# EAGLE board openDrive_MC_00.23 (EAGLE 5.10)
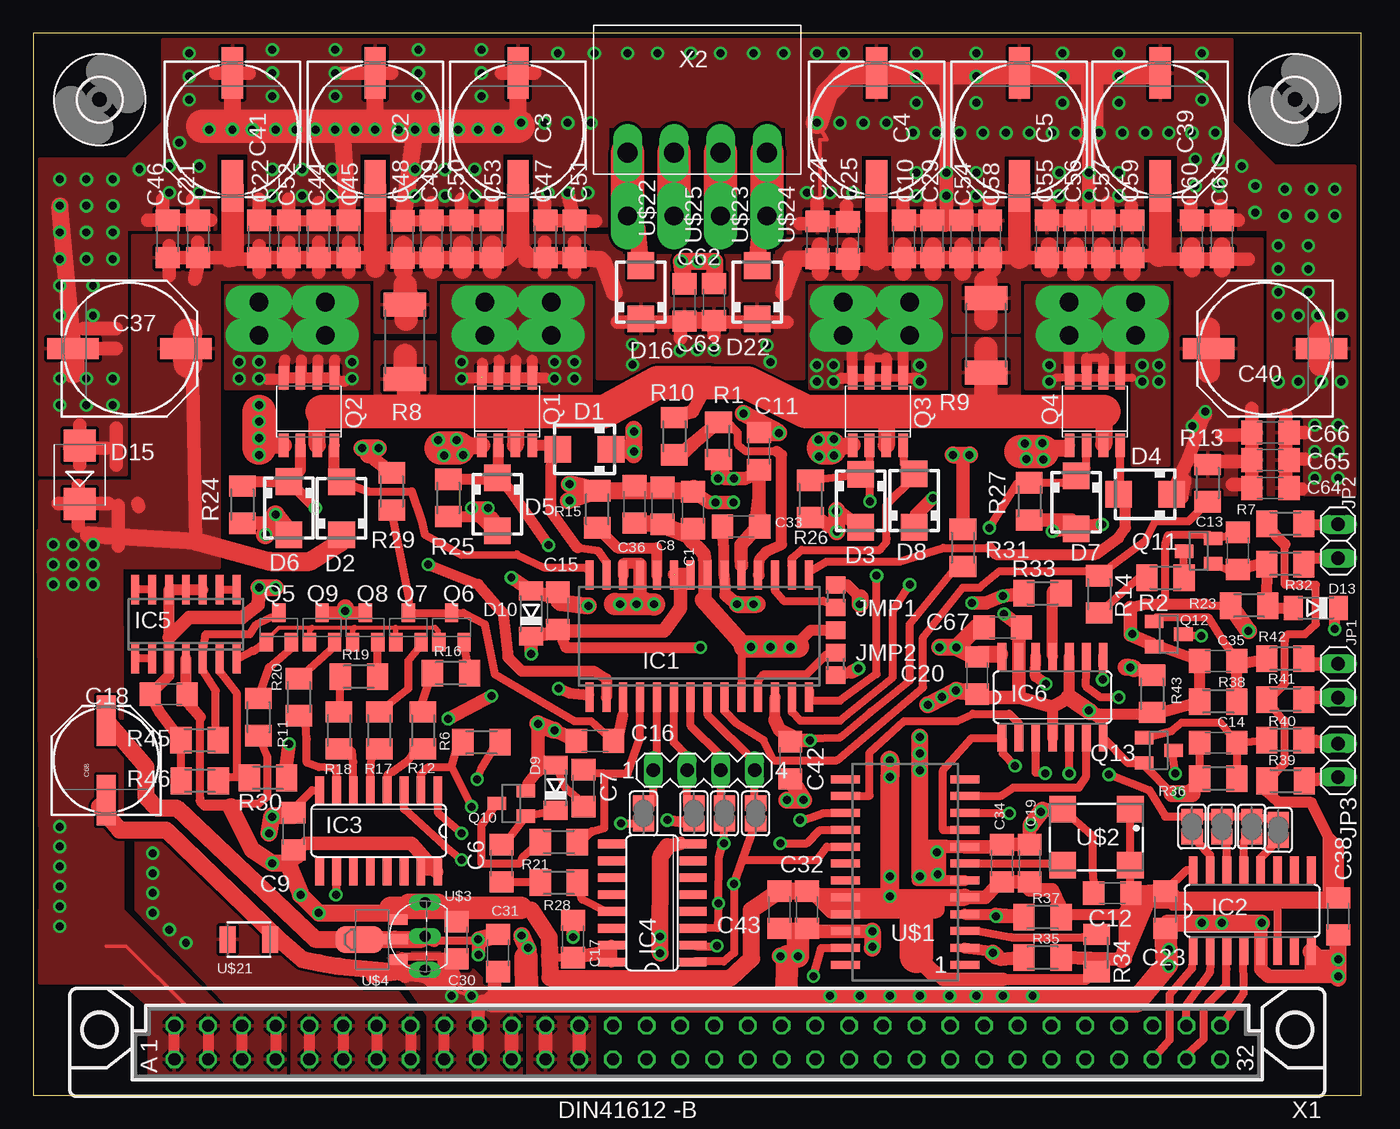
[diagram p1: board, top side]
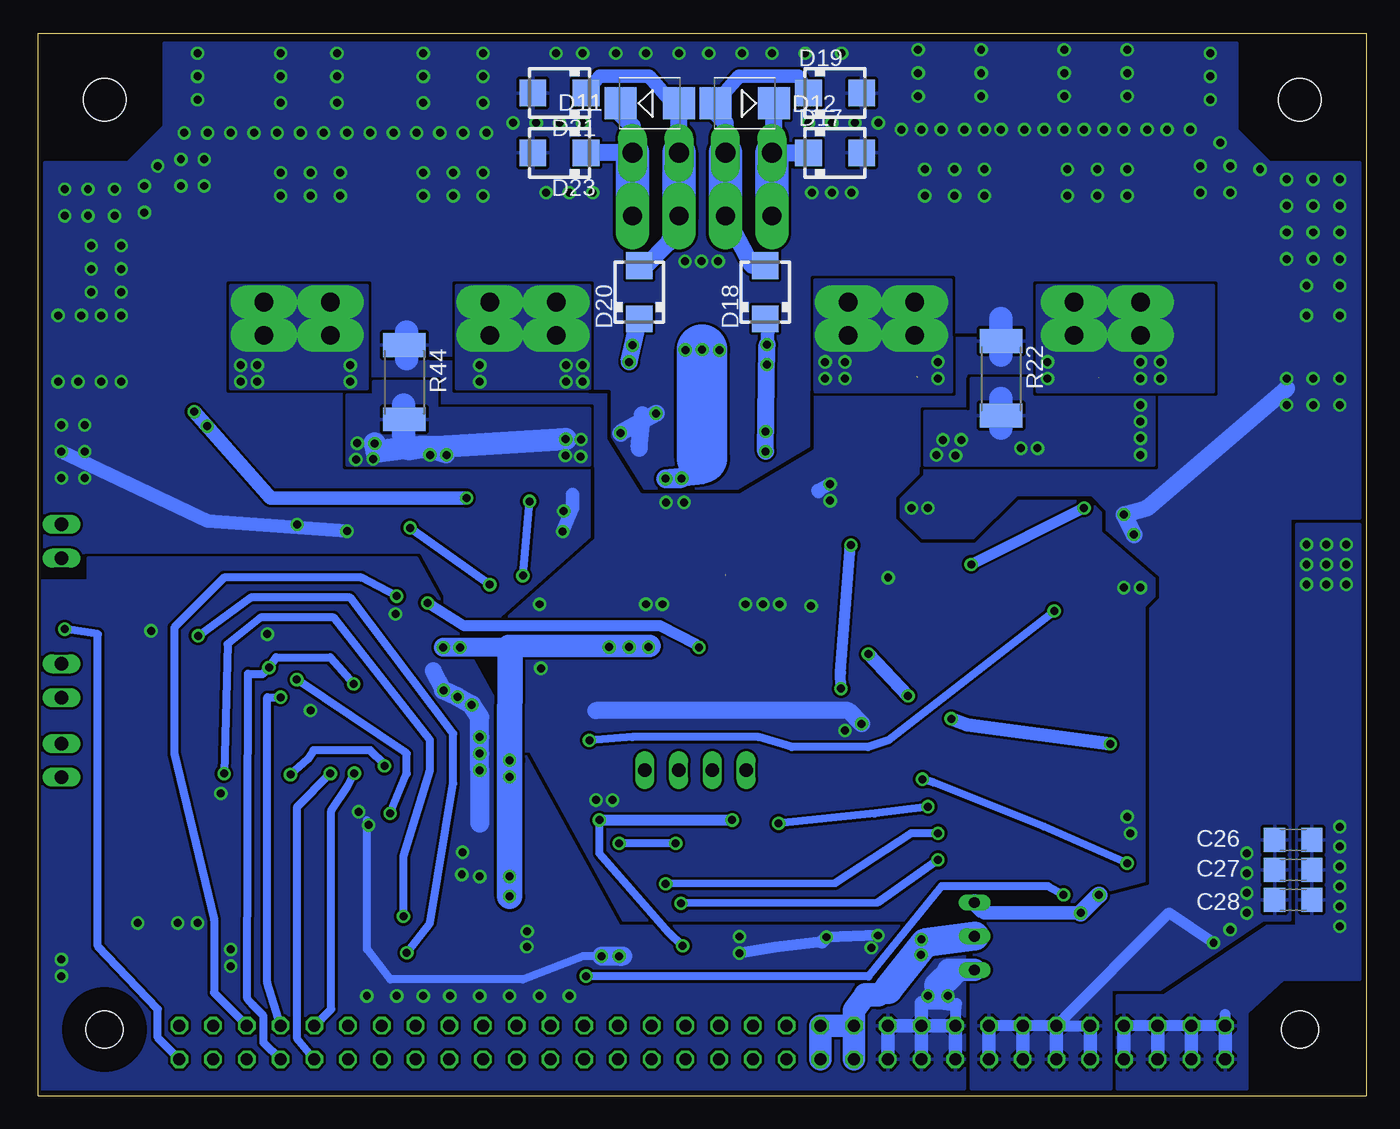
[diagram p2: board, bottom side, seen from below]

Size 100 x 80 mm. Coordinates in mm from the lower left corner, seen from the top.
Outline: 100,0 100,80 0,80 0,0 100,0
Copper layers (1*16): Top 0.035mm / dielectric 1.5mm / Bottom 0.035mm
Design rules "ZWILLING": minimum track width 0.2mm, minimum drill 0.5mm, track to track 0.2mm, track to pad 0.2mm, pad to pad 0.15mm, via to via 0.2mm, smd to smd 0mil, copper to edge 0.2mm, drill to drill 0.2mm, minimum pad ring 0.2mm, minimum via ring 0.2mm, stop-mask expansion 0.1mm, vias tented up to drill 0mil, thermal gap 10mil
bRestrict: 25 lines

## Footprints (pad centres in the part's own frame; a part is rotated, then mirrored left to right if it is on the bottom)
C1206 = smd 1.6 x 1.8: 1 -1.4,0; 2 1.4,0
PANASONIC_G = smd 3.9 x 1.6: + 4.25,0; - -4.25,0
PANASONIC_E = smd 3.8 x 1.4: + 3,0; - -3,0
SMA = smd 2 x 2: A 2,0; C -2,0
SOD80C = smd 1.4 x 1.8: A 1.7,0; C -1.7,0
SMB = smd 2.4 x 2.4: A 2.2,0; C -2.2,0
3,2 = hole 3.2: 0,0
SO28W = smd 0.6 x 2.2: 1 -8.255,-4.6; 2 -6.985,-4.6; 3 -5.715,-4.6; 4 -4.445,-4.6; 5 -3.175,-4.6; 6 -1.905,-4.6; 7 -0.635,-4.6; 8 0.635,-4.6; 9 1.905,-4.6; 10 3.175,-4.6; 11 4.445,-4.6; 12 5.715,-4.6; 13 6.985,-4.6; 14 8.255,-4.6; 15 8.255,4.6; 16 6.985,4.6; 17 5.715,4.6; 18 4.445,4.6; 19 3.175,4.6; 20 1.905,4.6; 21 0.635,4.6; 22 -0.635,4.6; 23 -1.905,4.6; 24 -3.175,4.6; 25 -4.445,4.6; 26 -5.715,4.6; 27 -6.985,4.6; 28 -8.255,4.6
SO16 = smd 0.66 x 2.032: 1 -4.445,-3.073; 2 -3.175,-3.073; 3 -1.905,-3.073; 4 -0.635,-3.073; 5 0.635,-3.073; 6 1.905,-3.073; 7 3.175,-3.073; 8 4.445,-3.073; 9 4.445,3.073; 10 3.175,3.073; 11 1.905,3.073; 12 0.635,3.073; 13 -0.635,3.073; 14 -1.905,3.073; 15 -3.175,3.073; 16 -4.445,3.073
SO14 = smd 0.6 x 2.2: 1 -3.81,-2.6; 2 -2.54,-2.6; 3 -1.27,-2.6; 4 0,-2.6; 5 1.27,-2.6; 6 2.54,-2.6; 7 3.81,-2.6; 8 3.81,2.6; 9 2.54,2.6; 10 1.27,2.6; 11 0,2.6; 12 -1.27,2.6; 13 -2.54,2.6; 14 -3.81,2.6
SO14' = smd 0.66 x 2.032: 1 -3.81,-3.073; 2 -2.54,-3.073; 3 -1.27,-3.073; 4 0,-3.073; 5 1.27,-3.073; 6 2.54,-3.073; 7 3.81,-3.073; 8 3.81,3.073; 9 2.54,3.073; 10 1.27,3.073; 11 0,3.073; 12 -1.27,3.073; 13 -2.54,3.073; 14 -3.81,3.073
B0R-JMP = smd 1.5 x 1.3: 1 0,1.7; 2 0,0; 3 0,-1.7
1X02 = drill 1.016 long: 1 -1.27,0; 2 1.27,0
SO08-IRF = smd 0.72 x 1.78: 1 -1.905,-2.543; 2 -0.635,-2.543; 3 0.635,-2.543; 4 1.905,-2.543; 5 1.905,2.543; 6 0.635,2.543; 7 -0.635,2.543; 8 -1.905,2.543
SOT23-BEC = smd 1 x 1.4: B -0.95,-1.1; C 0,1.1; E 0.95,-1.1
SOT23 = smd 1 x 1.4: 1 -0.95,-1.1; 2 0.95,-1.1; 3 0,1.1
M1206 = smd 1.6 x 2: 1 -1.4,0; 2 1.4,0
R2512 = smd 1.8 x 3.2: 1 -2.8,0; 2 2.8,0
SJ = smd 1.168 x 1.6: 1 -0.762,0; 2 0.762,0
MA04-1 = drill 1.016 long: 1 -3.81,0; 2 -1.27,0; 3 1.27,0; 4 3.81,0
SOP24 = smd 0.6 x 2.2: 1 -6.985,-4.5; 2 -5.715,-4.5; 3 -4.445,-4.5; 4 -3.175,-4.5; 5 -1.905,-4.5; 6 -0.635,-4.5; 7 0.635,-4.5; 8 1.905,-4.5; 9 3.175,-4.5; 10 4.445,-4.5; 11 5.715,-4.5; 12 6.985,-4.5; 13 6.985,4.5; 14 5.715,4.5; 15 4.445,4.5; 16 3.175,4.5; 17 1.905,4.5; 18 0.635,4.5; 19 -0.635,4.5; 20 -1.905,4.5; 21 -3.175,4.5; 22 -4.445,4.5; 23 -5.715,4.5; 24 -6.985,4.5
XO91 = smd 2 x 2: 1 -2.61,-2.07; 2 2.49,-2.07; 3 2.49,2.13; 4 -2.61,2.13
TO92 = drill 0.813 long: 1 -2.54,0; 2 0,0; 3 2.54,0
SOT89 = smd 0.8 x 1.4: 1 -1.499,-1.981; 3 1.499,-1.981 | smd 0.8 x 2.032: 2 0.025,-1.727 | smd 2.032 x 3.65: 4 0,0.94
PAD = drill 1.4 pad 2.54 long: 1 0,0
1210 = smd 1.2 x 2: 1 -1.6,0; 2 1.6,0
FAB64S = drill 0.914 octagon: A1 -1.27,39.37; A2 -1.27,36.83; A3 -1.27,34.29; A4 -1.27,31.75; A5 -1.27,29.21; A6 -1.27,26.67; A7 -1.27,24.13; A8 -1.27,21.59; A9 -1.27,19.05; A10 -1.27,16.51; A11 -1.27,13.97; A12 -1.27,11.43; A13 -1.27,8.89; A14 -1.27,6.35; A15 -1.27,3.81; A16 -1.27,1.27; A17 -1.27,-1.27; A18 -1.27,-3.81; A19 -1.27,-6.35; A20 -1.27,-8.89; A21 -1.27,-11.43; A22 -1.27,-13.97; A23 -1.27,-16.51; A24 -1.27,-19.05; A25 -1.27,-21.59; A26 -1.27,-24.13; A27 -1.27,-26.67; A28 -1.27,-29.21; A29 -1.27,-31.75; A30 -1.27,-34.29; A31 -1.27,-36.83; A32 -1.27,-39.37; B1 1.27,39.37; B2 1.27,36.83; B3 1.27,34.29; B4 1.27,31.75; B5 1.27,29.21; B6 1.27,26.67; B7 1.27,24.13; B8 1.27,21.59; B9 1.27,19.05; B10 1.27,16.51; B11 1.27,13.97; B12 1.27,11.43; B13 1.27,8.89; B14 1.27,6.35; B15 1.27,3.81; B16 1.27,1.27; B17 1.27,-1.27; B18 1.27,-3.81; B19 1.27,-6.35; B20 1.27,-8.89; B21 1.27,-11.43; B22 1.27,-13.97; B23 1.27,-16.51; B24 1.27,-19.05; B25 1.27,-21.59; B26 1.27,-24.13; B27 1.27,-26.67; B28 1.27,-29.21; B29 1.27,-31.75; B30 1.27,-34.29; B31 1.27,-36.83; B32 1.27,-39.37 | hole 2.794: 0.965,-45.009; 0.965,45.009
AKL182-04 = drill 1.5 pad 2.184 long: P$1 -5.25,0; P$2 -1.75,0; P$3 1.75,0; P$4 5.25,0

## Placement (x,y rotation side)
C1  4µ7  [C1206]  49.67,44.08 90 top
C2  330µ  [PANASONIC_G]  25.75,72.75 270 top
C3  330µ  [PANASONIC_G]  36.5,72.75 270 top
C4  330µ  [PANASONIC_G]  63.5,72.75 270 top
C5  330µ  [PANASONIC_G]  74.25,72.75 270 top
C6  10p  [C1206]  35.25,17.5 90 top
C7  680p  [C1206]  41.42,23.15 270 top
C8  100n  [C1206]  47.38,44.42 90 top
C9  100n  [C1206]  19.6,19.9 90 top
C10  4µ7  [C1206]  65.58,64.5 90 top
C11  1µ  [C1206]  54.65,48.52 90 top
C12  100n  [C1206]  81.25,15.25 180 top
C13  4n7  [C1206]  90.7,41.02 90 top
C14  4n7  [C1206]  89.22,26.57 180 top
C15  4µ7  [C1206]  39.5,36.5 90 top
C16  4n7  [C1206]  42.3,26.7 180 top
C17  100n  [C1206]  40.65,11.8 90 top
C18  100n  [C1206]  10.2,30.23 180 top
C19  1µ  [C1206]  75.03,17.5 90 top
C20  100n  [C1206]  71.08,31.62 270 top
C21  4µ7  [C1206]  12.43,64.5 90 top
C22  4µ7  [C1206]  17,64.5 90 top
C23  100n  [C1206]  85.25,14 270 top
C24  4µ7  [C1206]  59.05,64.42 90 top
C25  4µ7  [C1206]  61.35,64.4 90 top
C26  100n  [C1206]  5.5,19.25 180 bottom
C27  10n  [C1206]  5.5,17 180 bottom
C28  1n  [C1206]  5.5,14.75 180 bottom
C29  4µ7  [C1206]  67.7,64.5 90 top
C30  1µ  [C1206]  31.88,11.7 270 top
C31  1µ  [C1206]  35,10.75 270 top
C32  100n  [C1206]  58.25,14 270 top
C33  1µ  [C1206]  53.3,42.85 180 top
C34  470n  [C1206]  72.92,17.5 90 top
C35  4n7  [C1206]  89.22,32.73 180 top
C36  1µ  [C1206]  45.27,44.52 90 top
C37  330µ  [PANASONIC_G]  7.25,56.25 0 top
C38  1µ  [C1206]  98.25,13.5 270 top
C39  330µ  [PANASONIC_G]  84.85,72.75 270 top
C40  330µ  [PANASONIC_G]  92.75,56.25 180 top
C41  330µ  [PANASONIC_G]  15,72.75 270 top
C42  4n7  [C1206]  57,25.25 270 top
C43  1µ  [C1206]  56.17,14 270 top
C44  4µ7  [C1206]  21.5,64.5 90 top
C45  4µ7  [C1206]  23.75,64.5 90 top
C46  4µ7  [C1206]  10.12,64.5 90 top
C47  4µ7  [C1206]  38.58,64.5 90 top
C48  4µ7  [C1206]  27.82,64.47 90 top
C49  4µ7  [C1206]  30,64.5 90 top
C50  4µ7  [C1206]  32.25,64.5 90 top
C51  4µ7  [C1206]  40.75,64.5 90 top
C52  4µ7  [C1206]  19.25,64.5 90 top
C53  4µ7  [C1206]  34.5,64.5 90 top
C54  4µ7  [C1206]  69.9,64.5 90 top
C55  4µ7  [C1206]  76.33,64.5 90 top
C56  4µ7  [C1206]  78.45,64.5 90 top
C57  4µ7  [C1206]  80.58,64.5 90 top
C58  4µ7  [C1206]  72.05,64.5 90 top
C59  4µ7  [C1206]  82.75,64.5 90 top
C60  4µ7  [C1206]  87.25,64.5 90 top
C61  4µ7  [C1206]  89.5,64.5 90 top
C62  1n  [C1206]  49.05,59.73 90 top
C63  1n  [C1206]  51.27,59.75 90 top
C64  10n  [C1206]  93.15,45.75 0 top
C65  100n  [C1206]  93.15,47.85 0 top
C66  1µ  [C1206]  93.15,49.92 0 top
C67  4µ7  [C1206]  73,35.25 0 top
C68  220µ  [PANASONIC_E]  5.5,25.25 90 top
D1  SS14  [SMA]  41.51,48.66 180 top
D2  SS14  [SMA]  23.22,44.22 90 top
D3  SS14  [SMA]  66.33,44.81 90 top
D4  SS14  [SMA]  83.72,45.29 180 top
D5  SS14  [SMA]  34.94,44.53 270 top
D6  SS14  [SMA]  19.26,44.24 270 top
D7  SS14  [SMA]  78.51,44.68 270 top
D8  SS14  [SMA]  62.3,44.78 270 top
D9  BAS32  [SOD80C]  39.33,23.18 90 top
D10  3V0  [SOD80C]  37.48,36.3 90 top
D11  P6SMB 33CA  [SMB]  53.95,74.72 0 bottom
D12  P6SMB 33CA  [SMB]  46.8,74.72 180 bottom
D13  BAS32  [SOD80C]  96.58,36.73 180 top
D15  P6SMB 33CA  [SMB]  3.5,46.75 90 top
D16  SS14  [SMA]  45.75,60.5 90 top
D17  SS14  [SMA]  40,71 0 bottom
D18  SS14  [SMA]  45.25,60.5 90 bottom
D19  SS14  [SMA]  40,75.5 0 bottom
D20  SS14  [SMA]  54.75,60.5 90 bottom
D21  SS14  [SMA]  60.75,75.5 180 bottom
D22  SS14  [SMA]  54.5,60.5 90 top
D23  SS14  [SMA]  60.75,71 180 bottom
H1  MOUNT-HOLE3.2  [3,2]  5,75 0 top
H2  MOUNT-HOLE3.2  [3,2]  95,75 0 top
IC1  TMC249  [SO28W]  50.14,34.6 0 top
IC2  74HC138D  [SO16]  91.78,13.92 0 top
IC3  4094D  [SO16]  26.02,19.94 180 top
IC4  4094D  [SO16]  46.6,14.51 90 top
IC5  LM324D  [SO14]  11.5,35.5 0 top
IC6  74HC125D  [SO14']  76.75,30 0 top
JMP1  0R-JUMPB  [B0R-JMP]  60.42,33.35 0 top
JMP2  0R-JUMPB  [B0R-JMP]  60.42,36.75 180 top
JP1  Left Ref. Switch  [1X02]  98.25,31.25 90 top
JP2  STOP Switch  [1X02]  98.25,41.75 270 top
JP3  Right Ref. Switch  [1X02]  98.25,25.25 90 top
Q1  FDS8960  [SO08-IRF]  35.67,51.51 0 top
Q2  FDS8960  [SO08-IRF]  20.76,51.51 0 top
Q3  FDS8960  [SO08-IRF]  63.6,51.51 0 top
Q4  FDS8960  [SO08-IRF]  79.94,51.51 0 top
Q5  BC856ASMD  [SOT23-BEC]  18.5,35.25 0 top
Q6  BC856ASMD  [SOT23-BEC]  31.5,35.25 0 top
Q7  BC856ASMD  [SOT23-BEC]  28.25,35.25 0 top
Q8  BC856ASMD  [SOT23-BEC]  25,35.25 0 top
Q9  BC856ASMD  [SOT23-BEC]  21.75,35.25 0 top
Q10  BC846ASMD  [SOT23]  36,22 90 top
Q11  BC846ASMD  [SOT23]  87.75,41 90 top
Q12  BC846ASMD  [SOT23]  85.5,34.75 270 top
Q13  BC846ASMD  [SOT23]  84.75,26 270 top
R1  56  [M1206]  51.6,49.3 270 top
R2  1k  [M1206]  85.25,39 180 top
R6  120k  [M1206]  33.75,26.6 0 top
R7  4k7  [M1206]  94.28,43.08 180 top
R8  0.1  [R2512]  28,56.75 90 top
R9  0.1  [R2512]  71.75,57.25 90 top
R10  100  [M1206]  48.27,49.65 90 top
R11  10k  [M1206]  16.95,28.5 90 top
R12  10k  [M1206]  29.35,27.5 90 top
R13  120k  [M1206]  88.42,46.12 90 top
R14  4k7  [M1206]  80.25,37.75 90 top
R15  4k7  [M1206]  42.48,44.15 270 top
R16  10k  [M1206]  31.45,31.8 0 top
R17  10k  [M1206]  26.05,27.5 90 top
R18  10k  [M1206]  23.02,27.5 90 top
R19  10k  [M1206]  24.52,31.55 0 top
R20  10k  [M1206]  20,30 90 top
R21  4k7  [M1206]  39.58,19.1 180 top
R22  0.1  [R2512]  27.5,54 270 bottom
R23  33k  [M1206]  91.55,36.9 0 top
R24  470k  [M1206]  15.75,44.5 90 top
R25  470k  [M1206]  31.25,45 90 top
R26  470k  [M1206]  58.52,44.92 90 top
R27  470k  [M1206]  75,44.75 90 top
R28  1k  [M1206]  39.58,16.02 0 top
R29  100  [M1206]  27,45.5 90 top
R30  120k  [M1206]  17.68,23.93 0 top
R31  100  [M1206]  70,41.25 90 top
R32  4k7  [M1206]  94.28,40.02 0 top
R33  4k7  [M1206]  76,37.83 180 top
R34  33k  [M1206]  80.08,10.75 270 top
R35  33k  [M1206]  76,10.4 0 top
R36  33k  [M1206]  89.22,23.88 0 top
R37  33k  [M1206]  76,13.45 0 top
R38  33k  [M1206]  89.22,29.68 0 top
R39  4k7  [M1206]  94.3,23.7 180 top
R40  4k7  [M1206]  94.28,26.77 0 top
R41  4k7  [M1206]  94.28,29.82 180 top
R42  4k7  [M1206]  94.28,32.9 0 top
R43  120k  [M1206]  84.25,30.25 90 top
R44  0.1  [R2512]  72.42,53.73 270 bottom
R45  2k7  [M1206]  12.53,26.75 0 top
R46  22k  [M1206]  12.55,23.7 0 top
SJ1  ADR_CS_0  [SJ]  87.25,20.25 90 top
SJ2  ADR_CS_1  [SJ]  89.5,20.25 90 top
SJ3  ADR_CS_2  [SJ]  91.75,20.25 90 top
SJ4  ADR_CS_3  [SJ]  93.75,20 90 top
SJ5  [SJ]  52.05,21.25 90 top
SJ6  [SJ]  49.75,21.25 90 top
SJ7  [SJ]  45.95,21.25 90 top
SJ8  [SJ]  54.4,21.25 90 top
SV1  SPI_TEST_TMC249  [MA04-1]  50.5,24.5 0 top
U$1  TMC428  [SOP24]  65.65,16.84 90 top
U$2  XO91  [XO91]  80,19.5 180 top
U$3  MCP1702  [TO92]  29.5,12 90 top
U$4  MCP1702SMD  [SOT89]  25.5,11.75 90 top
U$5  PIN1  [PAD]  39,59.75 180 top
U$6  PIN1  [PAD]  34,59.75 180 top
U$7  PIN1  [PAD]  39,57.25 180 top
U$8  PIN1  [PAD]  34,57.25 180 top
U$9  PIN1  [PAD]  17,59.75 180 top
U$10  PIN1  [PAD]  22,57.25 180 top
U$11  PIN1  [PAD]  22,59.75 180 top
U$12  PIN1  [PAD]  17,57.25 180 top
U$13  PIN1  [PAD]  61,57.25 180 top
U$14  PIN1  [PAD]  66,57.25 180 top
U$15  PIN1  [PAD]  61,59.75 180 top
U$16  PIN1  [PAD]  66,59.75 180 top
U$17  PIN1  [PAD]  78,59.75 180 top
U$18  PIN1  [PAD]  78,57.25 180 top
U$19  PIN1  [PAD]  83,57.25 180 top
U$20  PIN1  [PAD]  83,59.75 180 top
U$21  2µ2  [1210]  16.25,11.75 180 top
U$22  PIN1  [PAD]  44.75,66.25 90 top
U$23  PIN1  [PAD]  51.75,66.25 90 top
U$24  PIN1  [PAD]  55.25,66.25 90 top
U$25  PIN1  [PAD]  48.25,66.25 90 top
X1  FAB64SE  [FAB64S]  50,4 90 top
X2  AKL18X-04W  [AKL182-04]  50,71 180 top

## Tracks (layer width: path | path; a pad name or v marks a point on that pad's centre or on a via)
+30V  (via drill 0.6)
  Top 0.254: 5.5,11.25 7,11.25 11.5,6.75 | C21.1 11.93,62.73 12.4,62.5 | C37.+ 11.5,55.4 11.65,55.25 | v52.75,46.45 53.17,46.67 53.55,46.45 | 52.08,46.48 51.52,47.08 | 45.25,48.75 45.09,48.69 | 46,58.25 D16.C 45,58.25 | C59.1 83.5,63.1 82.75,62 | C58.1 72.75,63.1 72.25,62.25 | 59.1,63.05 59.25,62.8 59.25,62.25 | C25.1 61.5,63 61.5,62.5 | D4.C 86.47,45.29 86.47,45.27 | 76.5,62.25 76.33,62.25 C55.1
  Top 0.61: IC1.19 53.31,39.91
  Top 0.813: X1.A1 X1.B1 | X1.B2 X1.A2 | X1.B3 X1.A3 | X1.B4 X1.A4 | 57.38,62.77 57.9,62.85 58.58,62.8
  Top 1.016: C22.1 C52.1 C44.1 C45.1 25.75,63.1 | 26,63.1 C48.1 C49.1 C50.1 C53.1 | 14.75,63 17.4,63 | 23.22,41.72 D2.C | 12.25,41.75 12,53.75 C37.+ | C58.1 C54.1 C29.1 C10.1 65.9,63 63.5,63 C25.1 57.08,63 | C58.1 74.25,63.1 C55.1 C56.1 C57.1 | C57.1 82.35,63.1 | 84.75,63.25 82.5,63.25 C57.1 | v67.75,45 66.5,43.75 D3.C | D4.C 86.97,47.97 v88.25,51.5 87.38,50.38 88.25,51.25 | 37.15,63.35 37.15,63 | C46.1 C21.1 14.43,63.1 | C47.1 C51.1 | 17,62 17,64 | 19.25,62 19.25,64.25 | 21.5,62 21.5,64.25 | 23.75,62 23.75,64.25 | 38.5,62 38.5,64.25 | 40.75,62 40.75,64.25 | R1.2 52.08,46.48 53.55,46.45 54.45,46.75 C11.1 54.65,44.95 | 54.65,44.95 C33.1 54.33,42.58 53.3,41.45 53.3,40.43 53.31,39.91 | 54.65,44.95 54.4,42.9 | v45.23,48.5 45.09,48.69 45.07,48.66 | 10.25,61.75 10.25,64 | 12.15,61.5 12.4,62.5 12.4,64.25 | 7.92,44.35 7.88,44.6 | 1.88,44.6 5.67,44.6 | 3.4,42.88 3.4,45.92 | 6.4,41.38 6.4,44.42 | C58.1 71.8,62.75 | 51.52,47.08 v51.55,46.48 | 48.75,57 48.75,58.5 51.25,58.5 51.25,58.25 | 51.25,58.25 51.25,57.25 | 85,63 87.25,63 89.5,63 91.5,63 | 51.25,58.25 56.75,58.25 | 44,58.25 46,58.25 51.25,58.25 | 89.5,49.75 91.5,49.75 | 89.25,47.75 91.25,47.75 | 90.28,46.02 91.78,46.02 | 91.75,46 91.75,51.75 | 86.47,45.02 86.47,45.27 86.72,46.3
  Top 1.27: 17.4,63 C22.1 | 25.75,63.1 26,63.1 | 14.75,63 15,63.25 | 4.15,42.25 12.25,41.75 | 37.15,63.35 36.5,64 35.6,63.1 C53.1 | 57.08,63 C24.1 59.1,63.05 58.58,62.8 | 43.75,60.5 42.92,62.73 42.69,62.98 41.19,63.1 C51.1 | 56.5,60.5 57.38,62.77 | 37.15,63 38.58,63 C47.1 | 70,62 70,64 | 72.25,62.25 72.25,64 | 67.75,62 67.75,64 | 65.5,62 65.5,64 | 76.5,62.25 76.5,64 | 78.5,62 78.5,64 | 80.5,62 80.5,64 | 82.75,62 82.75,64 | 87.25,62.25 87.25,63 87.25,64 | 89.5,62.25 89.5,63 89.5,64 | 61.5,62 61.5,62.5 61.5,64 | 59.25,62 59.25,62.25 59.25,64 | 45.25,48.75 45.23,48.25 v45.23,50 45.23,50.17
  Top 1.422: 23.22,41.72 20.82,40.23 17.82,40.23 12.25,41.75 | C52.1 19.25,63 | 45.07,48.66 D1.C | 30.07,62.2 30.07,64.08 | 32.33,62.2 32.33,64.08 | 34.58,62.2 34.58,64.08 | 25.77,62.28 25.77,64.65 | 27.88,62.16 27.88,64.03
  Top 1.676: 36.5,64 C3.+ | 15,63.25 C41.+ | 25.75,63.1 C2.+ | 63.5,63 C4.+ | 74.25,63.1 C5.+ | C39.+ 84.85,63.42 84.75,63.25 | 88.5,54.5 88.5,57.75
  Top 1.778: 28,60.25 28,61 | 71.75,59.5 71.75,61.25 | 71.75,58.5 71.75,59.25 | 28.07,58.45 28.07,60.33
  Top 2.184: 11.65,55.12 11.65,55.25 11.65,57.42
  Bottom 0.254: 50,48 49.5,48 49.25,47.75
  Bottom 0.813: 10.63,6.12 X1.B1 X1.B2 X1.B3 X1.B4
  Bottom 1.016: X1.A1 X1.B1 | X1.B2 X1.A2 | X1.B3 X1.A3 | X1.B4 X1.A4 | v88.25,51.5 82.5,45 v67.75,45 | D18.C 45,58.25 v45.12,56.55
  Bottom 1.27: v45.23,48.5 v45.12,56.55 | 49.92,46.77 50,48 | v55.5,55.25 D20.C
  Bottom 1.422: v51.55,46.48 v52.75,46.45 49.92,46.77
  Bottom 3.81: 50,48 v50,56.17
  other vias: 2,20.25 2,18.75 2,17.25 2,15.75 2,14.25 2,12.75 51.27,56.15 48.7,56.12 87.28,50.4 1.5,41.5 3,41.5 4.5,41.5 1.5,40 3,40 4.5,40 4.5,38.5 3,38.5 1.5,38.5 45.12,55.05 55.25,56.5
  pour Top: 6.6,42.5 6.65,13.85 6.62,10.8 0.65,10.7 0.45,42.5
  pour Top: 8.75,1.25 8.75,6.5 18.98,6.5 18.98,1.25
  pour Top: 0.5,14 0.5,8.5 6.75,8.5 9,6.5 14.25,6.5 6.75,14
  pour Top: 0.5,39.75 14,39.75 14,61.5 25.75,61.5 25.75,57.5 30.25,57.5 30.25,61.5 44.25,61.5 44.25,64.75 7.5,64.75 7.5,46.25 0.5,46.25
  pour Top: 42.5,63.25 58,63.25 58,57 42.5,57
  pour Top: 56,64.5 92.5,64.5 92.5,45.25 86,45.25 86,61.5 74.25,61.5 74.25,57.5 69.25,57.5 69.25,61.5 56,61.5
  pour Top: 42.5,54 42.5,57.25 58,57.25 58,54
  pour Bottom (rank 5): 9,0.5 18.75,0.5 18.75,7.5 15.25,7.5 7.5,12.75 5.25,12.75 5.25,43 0.5,43 0.5,8.75 6.25,8.75 9,6.25
AGND  (via drill 0.6)
  Top 0.254: 3.5,49 2.75,48.75 | 59.75,66 59,66 59,66.25 59.25,66.25 59.25,72 59.75,72 v59,73.25 | 94.33,46.25 94.55,46.25 C64.2 | 94.33,49.5 94.55,49.5 C66.2 | 49.75,45.75 47.38,45.75 C8.2
  Top 0.61: R46.1 R45.1 | 63.03,43.28 D8.A 62.76,43 61.75,43 62.12,42.88 | C9.2 19.6,21.6 21,23 IC3.8 | Q10.2 37.1,23.35 37.25,23.5 | 38,24.5 37.8,24.45 | C7.2 41.65,21.85 40,23.25 D9.A | D7.A 78.07,42.68 77.5,43.25 75.85,43.25 R27.1
  Top 0.813: 19.6,21.1 19.6,21.6 | 39.05,24.7 D9.A 37.8,24.45 | 37.25,23.5 38,24.5 | C50.2 C49.2 C48.2 | C45.2 C44.2 C22.2 | 18.4,43.1 D6.A | X1.B5 X1.A5 | X1.B6 X1.A6 | X1.B7 X1.A7 | X1.B8 X1.A8 | R25.1 34.62,43.6 D5.A | 45.7,39.48 45.67,40 45.65,40.05 44.42,40.05 IC1.26 | R45.1 9.6,28.77 C18.2 10.23,31.63 IC5.3 10.23,34.5 IC5.12 IC5.11 IC5.10 | 52.15,37.7 IC1.20 52,39.24 52,41.25 51.88,42.85 | JMP2.3 61.3,38.45 62.25,37.5 | JMP1.3 61.62,31.9 | 51.88,42.85 C33.2 | 51.88,42.85 51.62,42.85
  Top 1.016: v39.25,27.5 C16.2 | 38,24.5 v38,28 | R24.1 18.4,43.1 | C54.2 C29.2 C10.2 68.65,65.9 | C55.2 C56.2 C57.2 | C57.2 82.35,65.9 | 79.58,65.92 C57.2 | 79.5,72.25 79.5,66 | 68.75,76.75 68.75,66 | R27.1 78.15,43.35 78.75,42.75 v80.5,43 v76.75,42.5 | R26.1 59.02,43.52 v60.5,42.48 | 60.5,44.09 D8.A | C47.2 C51.2 v40.25,68 | 17,67.5 17,66.25 | 19.25,66.25 19.25,67.5 | 21.5,66 21.5,67.25 | 30,66.25 30,67.25 | 32.25,66 32.25,67.5 | 34.5,66 34.5,67.25 | 38.5,66.25 38.5,67.25 | 42.35,65.85 41.35,65.85 | 23.25,77 C2.- 27,77 | 13.75,77 16.25,77 | 35.25,77 37.75,77 | 3.75,57.75 6.25,57.75 | D5.A 34.94,42.31 v33,44.25 v34.25,44.25 | v36,39 D10.A 39.25,37.5 39.5,37.25 39.48,37.12 39.73,37.12 | 9.75,66.25 9.75,67.5 | 12,66.25 12,67.5 | 3.5,47.5 3.5,49 3.5,50.5 | 6.25,47.5 6.25,50.25 | 2.75,48.75 5.5,48.75 | 4.75,56.25 6.25,56.25 | C25.2 59.05,65.8 C24.2 | 45.7,37.45 IC1.25 | IC1.25 45.7,39.48 | 45.67,40 45.67,39.22 IC1.25 | 59,66.25 59,67.25 | 61.25,66 61.25,67 | 65.5,66.25 65.5,67.25 | 67.5,66 67.5,67 | 70.25,66 70.25,67 | 72,66.25 72,67.25 | 76.5,66 76.5,67 | 78.25,66 78.25,67 | 80.92,66.25 80.92,67.25 | 82.67,66 82.67,67 | 87.17,66 87.17,67 | 89.42,66 89.42,67 | 90.75,65.92 89.75,65.92 | 88.75,65.92 87.75,65.92 | 70.5,65.92 71.5,65.92 | 57.75,65.67 58.75,65.67 | 32.33,65.9 C53.2 | 12.12,65.92 13.38,65.92 | 11.88,65.92 10.62,65.92 | 9.88,65.92 8.62,65.92 | 95.75,49.92 94.75,49.92 | 95.75,47.92 94.75,47.92 | 95.5,45.67 94.5,45.67 | 94.33,50.5 94.33,51.25 | 94.33,49.5 94.33,48.5 | 94.33,46.25 94.33,47.25 | v17,38.25 16.93,36.95 15.75,36 11.73,36 10.23,34.5 | v53,37 52.15,37.7 | 61.62,31.9 v62.15,32.17 | C1.2 50.9,44.67 v52.73,44.67
  Top 1.27: v38,28 v39.25,27.5 | v46.75,37 45.7,37.45 | v41.8,36.88 39.73,37.12 C15.2 | v45.42,37 43.83,37.02 | C42.2 v58,22.25 v56.75,22.25 | 40.3,44.8 R15.1 | 15,73 C41.- | 25.75,73 C2.- | 36.5,73 C3.- | 28.75,73 C48.2 | C45.2 23.25,73 | D6.A 19.26,42.49 v18.25,43.75 | v60.5,42.48 60.5,44.09 | 3,56.5 C37.- v2,67 | v17,38.25 v18.25,38.25 | R15.1 v40.38,46.05 | v53.48,51.38 56.15,49.92 C11.2 | C63.2 v51.3,62.83 v48.8,62.83 C62.2 | 19.6,21.1 18,21.1 v17.75,19.75 | v53,37 54.5,37 | R15.1 45.9,45.55 | 45.9,45.55 C36.2 | 62.25,37.5 v62.25,37 | 45.9,45.55 49.75,45.55 49.75,45.75
  Top 1.422: v18.25,43.75 v17.5,42.25
  Top 1.676: 43.83,37.02 v46.75,37 | 79.5,66 79.58,65.92 | 79.5,72.25 79.75,72.5 79.75,76.75 | 79.75,76.75 79.75,77 C39.- | 79.75,76.75 79.5,77 C5.- 69,77 | 69,77 C4.- 61.25,77 59.75,75.5 v59,73.25 | 68.75,66 68.65,65.9 | 69,77 68.75,76.75 | 3,54.5 3,56 | 96.92,55 96.92,57.5
  Top 2.54: 36.5,73 28.75,73 25.75,73 23.25,73 15,73 12.75,73
  Bottom 0.813: v11.5,11.5 14.85,13.75 X1.B6 | X1.B6 X1.B5 | X1.B6 X1.B7 X1.B8 | R44.1 72.25,56.52 72.25,57.5 | v62.15,32.17 62.17,32.17 62.25,32.25
  Bottom 1.016: X1.B5 X1.A5 | X1.B6 X1.A6 | X1.B7 X1.A7 | X1.B8 X1.A8 | v76.75,42.5 87.25,43.25 v98.25,48.5 | v60.5,42.48 59.75,44.25 59.75,45.25 | v40.38,46.05 41.3,45.55 41.25,45.5
  Bottom 1.27: 58,29 39,29 v38,28 | v17.5,42.25 v18.25,43.75 16.5,44.25 6,53.25 | v53.48,51.38 56.15,49.88 | 54.75,48.75 54.5,51.25
  Bottom 1.778: 72.25,55.5 72.25,57.5 | 27.5,55.75 27.5,58.5
  other vias: 9,16.75 10.25,12.5 9,18.25 18,21 9,15.25 9,13.75 18,69.75 18,67.75 20.25,67.75 22.5,69.75 22.5,67.75 28.75,69.75 31,67.75 31,69.75 33.25,67.75 36.75,73.25 35,72.75 33.5,72.75 32,72.75 30.25,72.75 28.75,72.75 27.5,72.75 25.75,72.75 24.25,72.75 22.75,72.75 21.25,72.75 19.75,72.75 18.25,72.75 16.5,72.75 15,72.75 13.25,72.75 11,71.75 10.25,70 4,69 20.25,69.75 2,69 2,65 38.75,68 38.5,73.25 40.25,73.25 42,73.25 41.75,68 60.42,44.02 66.5,74.75 2,52 2,54 4,52 2,58.75 4.5,58.75 2,61 6,69 8,69.75 12.5,68 12.5,70 33.25,69.75 4,54 4.5,61 4,65 4,67 40.38,44.8 56.15,49.9 58.25,68 60,68 61.75,68 60.75,73.25 62.5,73.25 64.25,73.25 66.25,72.5 68,72.5 69.75,72.5 71.5,72.5 73.25,72.5 75,72.5 76.75,72.5 78.5,72.5 80.25,72.5 82,72.5 83.75,72.5 85.5,72.5 87.25,72.5 66.5,67.75 68.75,67.75 71,67.75 66.5,69.5 68.75,69.5 71,69.5 79.5,67.75 77.25,67.75 81.75,67.75 77.25,69.5 79.5,69.5 81.75,69.5 87.5,68.5 89.25,68.5 92,68.5 92,66.5 10.25,68 6,67 6,65 87.5,70.5 94.25,66.25 96.25,66.25 98,66.25 94.25,68.25 96.25,68.25 98,68.25 93.75,58.75 95.25,58.75 96.75,58.75 98.5,58.75 93.75,53.75 95.25,53.75 97,53.75 98.5,53.75 96.5,46.5 96.5,48.5 96.5,50.5 50.05,62.83 93.75,60.5 93.75,62.25 93.75,64 96,60.5 96,62.25 96,64 11.75,78.5 11.75,76.75 11.75,75 18,78.75 18,77 18,75.25 22.75,78.75 22.75,77 22.75,75.25 29,78.75 29,77 29,75.25 33.75,78.75 33.75,77 33.75,75.25 39.5,78.5 42.25,78.5 44.75,78.5 47,78.5 49.5,78.5 51.75,78.5 54.25,78.5 56.5,78.5 59,78.5 61,78.5 66.5,78.5 66.5,76.75 71,78.5 71,76.75 71,74.75 77.5,78.5 77.5,76.75 77.5,74.75 81.75,78.5 81.75,76.75 81.75,74.75 88,78.5 88,76.75 88,75 6,54 6,52 4,63 2,63 6,63 28.75,67.75 89.25,70.5 91,70 89,72.5 98.25,50.5 98.25,46.5 44.17,37 54.25,37 51.38,44.67
  pour Top: 19.5,1.25 19.5,7.75 27.5,7.75 29,5.75 29,1.25
  pour Top: 7.75,19.25 7.75,14 14.5,7 20.25,7 21,7.25 25.25,7.25 22.5,10.25 21.75,10 19.75,12 11.25,19.25
  pour Top: 16.25,71.75 24.5,71.75 24.5,65.75 16.25,65.75
  pour Top: 27,71.75 27,65.25 35.25,65.25 35.25,71.75
  pour Top: 43.25,65.5 37.75,65.5 37.75,71 13.75,71 13.75,65.25 7,65.25 7,46.75 0.5,46.75 0.5,70.5 7,70.5 9.75,73.25 9.75,79.5 43.25,79.5
  pour Top: 42.75,79.5 90.25,79.5 90.25,73.25 93.5,70 99.5,70 99.5,45.25 93,45.25 93,65.25 86.25,65.25 86.25,70.88 83.5,70.88 83.5,65 75.5,65 75.53,70.85 73.03,70.85 73,65.25 64.75,65.25 64.75,70.88 62.25,70.88 62.25,65 56.75,65 56.75,73 42.75,73
  pour Bottom (rank 6): 19.25,0.5 29.75,0.5 29.75,13.25 99.5,13.25 99.5,70.25 93.25,70.25 90.5,73 90.5,79.25 9.75,79.25 9.75,72.75 7.25,70.25 0.5,70.25 0.5,43.5 5.75,43.5 5.75,13.25 7.75,13.25 15.5,8 19.25,8
GND  (via drill 0.6)
  Top 0.254: 30.21,9 28,9 v33,7.5 31.25,9 | U$4.1 27.75,10.5 | IC2.8 96.5,10.5 | 37.27,10.97 37.5,10.3 37.12,10.4
  Top 0.406: 88.22,37.02 88.39,37.06 87.5,37.25 | Q12.2 84.2,34
  Top 0.61: 90.8,42.48 C13.2 90.03,42.17 Q11.2 88.55,42.25 85.75,42.25 85.45,42.2 85.25,41.5 85.25,37.02 | 59.1,12.35 58.83,12.38 | 61.13,12.38 U$1.22 | 67.77,18.61 68.1,18.5 | C34.2 72.84,18.75 | C12.2 79.85,15.6 79.75,17 79.75,19.58 U$2.2 77.44,21.5 | 57.58,12.07 C32.2 | 80.56,28.19 IC6.7 82.44,25.05 Q13.2 83.65,24.85 85.75,22.75 | C20.2 71.65,30 | 74.25,30 74.21,30.04 | 78,33.05 IC6.10 | Q12.2 84.45,33.8 85,33.75 | 87.25,22.75 87,23.15 R36.1 C14.2 | 92.5,10.93 IC2.5 92.42,10.76 | v92.5,13 92.42,12.66 | C23.2 85.4,13 | 97.75,9 96.22,8.97 | 84.5,28.75 R43.1 | 48.73,18.98 IC4.8 | R23.1 88.55,36.9 88.39,37.06 | 27.75,10.5 31.75,10.5 | 30.75,9.5 30.75,10.25
  Top 0.813: X1.A9 X1.B9 | X1.B10 X1.A10 | U$1.6 66.55,16.2 68.1,16.5 | 80.56,28.19 79.6,28.91 80.19,28.75 84.5,28.75 R38.1 C35.2 85,33.75 | 78,30 78,33.05 | 70.9,30.35 C20.2 | 76.75,29.25 IC6.4 | v69.47,30.52 71.25,30 | 88.22,37.02 85.25,37.02 83.72,37.02 82.62,36.75 | C32.2 C43.2 | 74.21,34.71 74.25,34.75 74.25,35.1 C67.2
  Top 1.016: U$3.1 25.54,8.96 | C32.2 59.1,12.35 | 58.83,12.38 61.13,12.38 | 67.77,18.61 67.33,18.77 68.73,18.77 U$1.8 72.84,18.75 | C34.2 C19.2 75,20.25 v75.12,20.38 | 76,21.5 77.44,21.5 | 71.65,30 74.25,30 76.75,29.25 78,30 | 74.21,30.04 IC6.13 74.21,34.71 | 92.42,12.66 IC2.5 | 96.22,8.97 IC2.8 | 97.75,9 93,9 92.42,9.5 92.42,10.76 | 82.62,36.75 82.62,34.7 84.2,34 | 47.75,18.75 48.73,18.98 | X1.B11 X1.A11 | 34.62,7.1 33.85,7.1 33.5,6.75 X1.B10 | 28,9 27.73,9.27 | v63.17,12.38 61.02,12.38 | 96.5,10.5 98,10.5 | v40.64,11.94 C17.2 | C31.2 34.75,9.35 34.75,7.1 | v73.1,36.27 74.25,35.38
  Top 1.27: 68.1,18.5 68.1,16.5 | v75.12,20.38 76,21.5 | 78,30 79.6,28.91 | 85.75,22.75 87.25,22.75 | 85.4,13 v92.5,13 | 54.38,7.1 56.7,7.33 54.58,7.1 | v56.25,10.5 56.75,10.5 v57.58,10.5 | 70.9,30.35 v69.47,30.52 v67.35,29.43 | 67.77,18.61 66.75,16.53 v66.75,24.5 v66.75,25.75 v66.75,27 | IC2.8 98.25,8.85 C38.2 | v47.2,10.72 47.25,18 47.75,18.75 | 37.27,10.97 v36.77,12.05 | v91.5,35 90.25,36.75 | v63.17,12.38 63.17,11.12 | C68.- 5,21.75 6.5,20 10,20 18.5,11.75 | 31.25,9 23,9.75 21.5,10 20.25,10.25 18.5,11.75 | 18.5,11.75 U$21.1
  Top 1.676: v57.58,10.5 57.58,12.07 | 34.62,7.1 34.75,7.1 54.38,7.1 | 56.7,7.33 56.75,10.5 | C23.2 85.35,9.85 83.08,7.1 54.58,7.1
  Top 1.778: 37.15,7.6 37.12,10.4
  Top 1.93: 31.25,9 30.21,9
  Bottom 0.61: v75.12,20.38 75.25,20.75 75.25,11 73.5,8.75 63.5,8.75 59,10.5 v57.58,10.5
  Bottom 0.813: X1.A9 X1.B9 30.86,6.92 31.45,6.92 | 30.95,5.2 31,5.25 | 33.47,5.25 X1.B10 | v47.2,10.72 44.5,11.18 40.98,11.57 | v36.77,12.05 v40.64,11.94
  Bottom 1.016: X1.B10 X1.A10 | X1.A9 30.95,5.2 | 31,5.25 33.47,5.25 | 31.45,6.92 32.2,7 | 32.2,7 32.2,8.27 | X1.A11 X1.B11 X1.B10 33.5,7 32.2,7 | v40.64,11.94 40.98,11.57
  Bottom 1.27: 31.46,9.46 31.25,9.22 31.45,8.72 | v69.47,30.52 70.25,32
  Bottom 1.422: v57.58,10.5 v56.25,10.5 56,10.5 | v69.47,30.52 v68.42,30.02 v67.35,29.43 66.75,28.5 v66.75,27 v66.75,25.75 v66.75,24.5 66.75,20.5
  Bottom 1.676: 31.46,9.46 U$3.1
  Bottom 2.184: 32.2,8.27 31.25,9.22
  other vias: 37.27,11.12 98.25,10.25 79.5,29 88,13 89.5,13 75.25,7.5 73,7.5 71,7.5 69,7.5 66.75,7.5 64.5,7.5 62.25,7.5 60,7.5 66.75,16.5 68.1,16.65 68.05,18.32 82.75,34.75 86.25,22.75 63.2,11.2 75.88,21.38 85.5,11 85.5,9.75 98.25,9 47.2,11.97 31.5,7.5
  pour Bottom: 96.25,40.5 71.5,40.5 56.25,12.75 30.25,12.75 30.25,8.75 30.25,0.5 99.75,0.5 99.75,38.75 96.25,38.75
  pour Top: 29.75,6 29.75,1.25 36.75,1.25 36.75,6 31.75,10.75 26.5,10.75
N$1
  Top 0.61: IC1.15 58.45,39.45 59.73,40.2 65.22,40.2 68.5,41.25 72,41.25 | Q4.4 81.84,45.91 D4.A 81.76,45.75 82.25,45.75
  Top 0.813: 82.25,45.75 82.25,42.75 81.72,41.97 80,40.75 72.5,40.75 72,41.25
N$2
  Top 0.61: U$1.7 77.41,17.48 U$2.3
N$3
  Top 0.254: 65.5,48.85 65.56,48.85 65.56,48.31
  Top 0.61: Q3.4 65.56,48.91 65.5,48.85 | IC1.16 57.1,40.45 57.85,41.1 63.75,41.1 64.22,41.67 64.25,41.92 64.25,44.5 66.33,46.59 D3.A 65.56,47.59 65.56,48.31
N$4  (via drill 0.6)
  Top 0.61: v78,24.25 78,26.91 IC6.5
  Bottom 0.61: X1.A28 80.5,4.27 80.5,21.75 v78,24.25
N$5  (via drill 0.6)
  Top 0.254: Q4.7 82.25,54.05
  Top 0.61: Q4.8 Q4.7 Q4.6 Q4.5 | 79.3,54.52 79.28,54.52 | 80.58,55.52 79.3,55.52 | 77.97,54.05 76.97,54.05 | 82.72,54.05 82.25,54.05 81.72,54.05
  Top 0.813: Q4.5 81.84,56.59 | Q4.8 78.03,56.47 | 79.3,55.52 79.3,54.52 | 80.58,55.52 80.58,54.62
  other vias: 76.5,55 76.5,53.75 83.5,55 84.75,55 83.5,53.75 84.75,53.75
  pour Top (no thermals): 74.75,61 74.75,53.25 77.25,53.25 77.25,55.25 82.75,55.25 82.75,47.5 85.5,47.5 85.5,61
  pour Bottom (no thermals): 75.25,53.25 85.5,53.25 85.5,61 75.25,61
N$6  (via drill 0.6)
  Top 0.254: 16.73,48.97 16.73,48.77 17,48.75 v17,48.25 | 30.7,48.75 30.7,48.42 v30.93,48.2
  Top 1.016: 25.25,48.25 R29.2
  Top 1.27: 16.73,48.97 Q2.1 | Q1.1 32.78,48.97 32.75,49 32.5,49 32,48.75 | 25.25,48.25 v26,48.75 v24.75,48.75
  Top 2.54: 30.7,48.75 32,48.75 | 17,48.75 17,51.5
  Bottom 1.778: 27.5,50.25 27.5,52.5
  other vias: 32.38,48.25 31.88,49.38 17,49.5 17,50.75 17,52 30.5,49.38
  pour Bottom (rank 4): 16,54 29.75,54 29.75,51.5 33.25,51.5 33.25,47.5 16,47.5
N$7  (via drill 0.6)
  Top 0.61: Q3.8 Q3.7 Q3.6 Q3.5 | 62.98,55.55 64.22,55.55 | 64.22,54.23 64.25,54.23 64.25,54.25
  Top 0.813: Q3.8 61.7,56.8 | Q3.5 65.5,56.76 | 62.98,55.55 62.98,54.55 | 64.22,55.55 64.22,54.23 | 60.8,54.02 61.8,54.02 | 65.55,54.02 66.55,54.02
  other vias: 60.25,55 59,55 59,53.75 60.25,53.75 66.75,53.75 66.75,55
  pour Top (no thermals): 58.5,61 58.5,53.25 60.9,53.25 60.9,55.5 66.25,55.5 66.25,53.25 68.75,53.25 68.75,61
  pour Bottom (no thermals): 68.5,61 68.5,53.25 58.5,53.25 58.5,61
N$8
  Top 0.61: IC1.28 41.88,39.45 41.58,39.75 39.08,39.75 38.48,39.77 36.4,40.75 32.25,40.73 29.48,42.25 29.25,43.25 28.5,45.5 25.25,45.5 23.28,46.22 D2.A
  Top 0.813: Q2.4 22.66,46.77 D2.A
N$9  (via drill 0.6)  (1 unrouted)
  Top 0.61: 18.85,54.1 20.18,54.1 20.18,54.08 20.12,54.08
  Top 0.813: Q2.8 Q2.7 Q2.6 Q2.5 | 22.7,54.15 22.7,55.41 | 21.45,54.15 21.45,55.41 | 20.2,54.15 20.2,55.41 | 18.95,54.15 18.95,55.41 | 17.59,53.95 18.86,53.95 | 22.89,53.8 23.41,53.8
  other vias: 17,55.25 17,54 24,54 24,55.25 15.5,55.25 15.5,54
  pour Top: 23.75,53.25 17.75,53.25 17.75,55.75 23.75,55.75
  pour Top (no thermals): 14.5,53.25 17.75,53.25 17.75,55.75 23.75,55.75 23.75,53.25 25.25,53.25 25.25,61 14.5,61
  pour Bottom (no thermals): 11.5,61 24.75,61 24.75,53 11.5,53
N$10  (via drill 0.6)
  Top 0.61: 41.83,30.18 41.71,30.18 IC1.1
  Top 0.813: 41.83,30.18 40.33,30.32 v39.55,30.65 | Q1.2 35.03,46.38 D5.C | R25.2 35.06,46.4 D5.C | D5.C 35.94,45.56 v38.8,41.45
  Bottom 0.254: 38.83,41.45 v38.8,41.45
  Bottom 0.813: 38.83,41.45 39.58,31.85 v39.55,30.65
N$11
  Top 0.61: 37.78,48.97 Q1.4 | 39.62,48.95 39.66,48.75 D1.A 39.99,48.74 39,47.5 | 41,41.25 42.58,41 43.17,40.15 43.17,39.22 IC1.27
  Top 0.813: 39.62,48.95 37.78,48.97 | 39,47.5 39,44 41,41.25
N$12  (via drill 0.6)  (1 unrouted)
  Top 0.813: 32.77,54.05 Q1.8 Q1.7 Q1.6 Q1.5 38.55,54.05 | 33.82,55.13 33.82,54.16 | 35.07,55.38 35.07,54.41 | 36.32,55.38 36.32,54.41 | 37.57,55.38 37.57,54.41
  other vias: 32.25,55.25 32.25,54 39.25,55.25 39.25,54 40.75,55.25 40.75,54
  pour Top (no thermals): 30.75,53.25 30.75,61 42,61 42,53 38.5,53 38.5,55.5 33,55.5 33,53.25
  pour Top: 32.75,53.25 38.75,53.25 38.75,55.75 32.75,55.75
  pour Bottom (no thermals): 31.27,61.4 31.25,53 41.5,53 41.52,61.4
N$13  (via drill 0.6)
  Top 0.813: Q2.2 20.12,47.1 D6.C | D6.C 16.09,46.24 R24.2 | D6.C v21.25,44.25 | IC1.2 43.15,31.38 42.23,31.98 36.77,31.98 35.75,33 35.38,36.32 33.5,38.5 v29.75,40
  Bottom 0.813: v21.25,44.25 v29.75,40
N$14
  Top 0.61: IC1.4 45.7,26.95 44.75,24.25 43,24.25 | R21.1 41.08,19 42.08,19.9 43,20.15 43,24.25 | 43,24.25 41.6,24.25 C7.1
N$15  (via drill 0.6)
  Top 0.61: v66,38.48 64.72,36.5 64.72,31.5 60.75,28.25 57.75,28.25 57.12,28.88 IC1.13 | Q4.2 79.31,47.23 D7.C 77.73,46.15 R27.2 74.15,46.15 v72,42.75
  Bottom 0.61: v66,38.48 v72,42.75
N$16  (via drill 0.6)  (1 unrouted)
  Top 0.61: R30.2 18.95,23.95 | IC1.22 49.3,39.2 49.25,39.25 | v73.01,37.61 72.24,37.11 71.73,37.11
  Top 0.813: C15.1 39.5,35 | 39.25,34.85 C15.1 | v50.25,33.75 40.1,33.75 C15.1
  Top 1.016: 18.95,23.95 v19.27,26.48 | v31.25,28.38 v34.5,30.1 | 39.5,35 47.5,35 48.73,36.73 48.73,39.23 48.75,39.25 | v70.67,37.1 71.73,37.11 v73.01,37.61 R33.2 | 48.75,39.25 48.28,39.25 | 48.75,39.25 49.25,39.25 | 39.25,34.85 D10.C v37.5,33.25
  Bottom 0.61: X1.B30 84.29,5.29 86.75,7.75 86.75,13.25 89.75,25.75 89.75,35.25 86,39 75.66,39 v73.01,37.61
  Bottom 0.813: v50.25,33.75 50.48,33.98 53.17,35.38 67.92,35.38 v70.67,37.1
  Bottom 1.016: v34.5,30.1 v37.5,33.25 | v19.27,26.48 30.02,27.93 v31.25,28.38
N$17
  Top 0.61: 54.65,40.33 54.65,40.24 54.62,39.72 | 48.62,48.12 R10.1 | 52.1,50.9 53.05,49.9 53.08,49 53.7,48.5 56,48.5
  Top 0.813: 52.1,50.9 R1.1 | 54.65,40.33 55.25,41 56.35,41.5 56.35,48.25 56,48.5 | IC1.18 54.65,39.2 54.65,40.24
  Top 1.016: 48.62,48.12 49.73,49.15 R1.1
N$18
  Top 0.61: IC5.6 14.06,31.89 15.35,30.25 15.35,24 | 15.35,24 13.65,24 R46.2 | 15.35,24 15.7,24 R30.1
N$19
  Top 0.61: IC1.7 49.51,27.84 51.77,25.57 SV1.3 51.77,22.29 SJ5.2
N$20
  Top 0.406: 44.42,28.98 44.42,29.5 IC1.3
  Top 0.61: 44.02,26.77 C16.1 42,28.2 40.75,28.2 34.75,31.75 34,35.5 32.4,36.35 Q6.C Q7.C 28.3,37.48 27,44.08 R29.1 | 44.4,28.65 44.4,29.32 44.42,29.5
  Top 0.813: 44.02,26.77 44.4,28.65
N$21
  Top 0.61: R16.2 32.4,34.1 Q6.E
N$22  (via drill 0.6)
  Top 0.254: C42.1 57.25,27
  Top 0.61: Q8.C 23.6,36.35 23.5,36.75 | 57.6,26.75 C42.1 58.3,26.9 60.77,26.98 63.08,28.9 66,31.25 66,35.5 69.25,39.5 69.85,39.75 R31.1
  Top 0.813: 55.85,28.3 IC1.12
  Top 1.016: Q9.C Q8.C | v58.5,26.75 57.6,26.75 | 55.85,28.3 56.2,27.55 57.25,27
  Top 1.27: 23.5,36.75 v23.5,36.5
  Bottom 0.61: v23.5,36.5 36,26.75 37.5,26.25 43.25,26.25 45.75,27 55.25,27 v58.5,26.75
N$23
  Top 0.61: Q7.E 29.2,33.95 28.25,32.75 28.25,30.65 R17.2
N$24
  Top 0.61: IC1.11 54.6,30.02 54.6,31.27 55.02,31.75 58.25,31.75 59.75,33.25 60.33,33.25 JMP1.2
N$25
  Top 0.305: 17.55,34.3 18.5,35.25 21,35.25 24.2,35.25 27.3,35.25 30.25,35.25
  Top 0.406: Q5.B 17.55,34.3 | 30.25,35.25 30.5,35 30.5,34.2 Q6.B | 27.3,35.25 Q7.B | Q8.B 24.05,35.1 24.2,35.25 | Q9.B 20.8,35.05 21,35.25
  Top 0.61: IC5.7 15.5,32.96 16.5,33.5 16.65,33.5 Q5.B
N$26
  Top 0.61: Q8.E 25.95,31.7 R19.2
N$27
  Top 0.61: Q9.E 22.7,33.85 R20.2
N$28
  Top 0.813: R15.2 44,41.25 46.95,41.25 46.95,39.23 IC1.24
N$29
  Top 0.61: R16.1 29.1,29.05 R12.2
N$30
  Top 0.61: R19.1 23.1,29.05 R18.2
N$31
  Top 0.61: R12.1 29,25.95 28.75,25.7 28.55,25.7 28.15,25.15 27.1,24.4 26.7,24.2 26.7,23.31 IC3.4
N$32
  Top 0.61: R17.1 25.5,26 25.4,24.4 25.4,23.28 IC3.5
N$33
  Top 0.61: R18.1 24,25.95 24.1,25.1 24.1,23.28 IC3.6
N$34
  Top 0.61: IC3.7 22.84,24.66 21.5,24.75 20.6,25.07 20.6,26.82 20.5,28 R20.1
N$35  (via drill 0.6)
  Top 0.61: 49.51,20.49 SJ6.1 49.24,20.49 | IC4.2 49.97,11.25 51.5,11.22 v51.48,11.28 | U$1.15 59.53,21.29 58.7,20.98 57.97,20.75 v57.75,20.75
  Top 0.813: v47.75,20.75 49.74,20.5 SJ6.1
  Bottom 0.61: v51.48,11.28 52.5,12.25 57.75,18.25 v57.75,20.75
  Bottom 0.813: v57.75,20.75 v47.75,20.75
N$36  (via drill 0.6)
  Top 0.61: IC3.3 27.93,21.57 31,18.75 v32.25,17.75 | IC4.3 51.52,12.62 v51.6,14.47 51.62,17.93 51.88,18.77 v52,19 52.02,19.21 SJ5.1 | v56.25,19 58.25,19 59.25,20 61.13,20 U$1.16
  Bottom 0.61: v32.25,17.75 36.83,14.53 v51.6,14.47 | v52,19 v56.25,19
N$37  (via drill 0.6)
  Top 0.61: IC3.1 30.49,21.26 v32.25,19.75 | 53.4,17.75 v52.75,15.95 52.77,10.75 52,10.1 49.81,10.1 IC4.1 | 53.4,17.75 SJ8.1 | U$1.17 59.74,18.75 59,17.75 53.4,17.75
  Bottom 0.61: v32.25,19.75 34.25,19.75 40,16 v52.75,15.95
N$38  (via drill 0.6)
  Top 0.61: IC3.10 22.84,15.6 v22.8,15.12 | v58.75,9 59.35,11.12 U$1.23
  Bottom 0.61: v22.8,15.12 23.98,15.78 31.98,15.78 37.48,8.97 v58.75,9
N$39  (via drill 0.6)
  Top 0.61: IC3.2 29.2,24.2 29.75,24.75 31.5,24.75 | v44.25,20.5 46.19,20.5 SJ7.1 | 31.5,24.75 v33,21.75 | 31.5,24.75 32,26.5 R6.1
  Bottom 0.61: v33,21.75 37,21.25 v44.25,20.5
N$40
  Top 0.61: IC1.17 55.85,37.99 56.5,37.25 59.5,37.25 JMP2.2
N$41  (via drill 0.6)
  Top 0.61: IC6.9 79.29,31.96 79.28,30.82 80.38,30 v81.75,30
  Bottom 0.61: v81.75,30 82.75,30 82.75,8.52 X1.B29
N$42
  Top 0.254: 71.75,52 64.25,52 64.25,51.5
  Top 0.813: 80.6,49.04 Q4.3 | 64.25,51.5 64.23,50.98 | 21.39,50.9 21.75,51.5 | 28.27,53.48 R8.1
  Top 1.016: R10.2 48.9,51.33 49.62,51.52 50.85,53.7
  Top 1.27: 80.6,51.5 80.6,49.04 | 64.23,50.98 Q3.3 | Q2.3 21.39,50.9 | Q1.3 36.3,51.45 36.25,51.5
  Top 1.778: 28.25,51.5 28.27,53.48 | 71.75,52 71.75,53.5 | 71.75,54.75 71.75,56.25 | 28,54.5 28.02,55.73
  Top 2.54: 21.75,51.5 28.25,51.5 36.25,51.5 | 80.6,51.5 64.25,51.5 58.17,51.5 53.83,53.65 50.85,53.7 47.02,53.67 43,51.5 36.36,51.5 36.3,51.45
  pour Top: 25.75,56.75 30.25,56.75 30.25,52.25 25.75,52.25
  pour Top: 69.25,57 74.25,57 74.25,52.25 69.25,52.25
N$43
  Top 0.61: R7.1 95.73,43.02
  Top 0.813: 95.73,43.02 JP2.1
N$44
  Top 0.813: JP2.2 96.16,40.48 R32.2
N$45  (via drill 0.6)
  Top 0.61: Q3.2 63,48.93 63,46.81 D8.C | v63.5,39.15 63.5,31.75 60.75,29.75 58.5,29.75 58.5,30.5 58.4,30.39 IC1.14 | v63,44.75 63,46.76 D8.C | R26.2 61.87,46.67 D8.C
  Bottom 0.61: v63.5,39.15 v63,44.75
N$46
  Top 0.61: IC6.2 74.21,28.04 73.5,28.75 70.75,28.75 69.58,28.2 65.58,28.2 62.98,25.82 62.98,22.57 61.17,22.57 U$1.14
N$47
  Top 0.61: R21.2 36.9,18 36.65,17.5 33.75,17.5 33.75,20.35 Q10.3
N$48
  Top 0.61: R14.1 83.25,39 R2.2
N$49
  Top 0.61: C6.2 35.5,18.95 Q10.1 D9.C
N$50
  Top 0.61: IC5.2 IC5.1
N$51
  Top 0.61: R28.2 41.33,14.78 43.15,13.85 43.55,13.93 IC4.13
N$52
  Top 0.61: R28.1 38,16.1 C6.1
N$53
  Top 0.61: IC5.9 IC5.8
N$54
  Top 0.61: IC5.13 IC5.14
N$55
  Top 0.813: R33.1 77.15,37.85 76.75,38 IC6.11
N$56
  Top 0.61: IC1.9 52.05,28.95 53,28 55,26.75 55.73,25.25 60.5,25.25 67,30.75 67,34.5 70,38.25 71.25,38.25 72.75,39.5 79.9,39.5 R14.2 83.75,41.75 84.5,43.25 87,43.25 88.47,44.73 R13.1
N$57
  Top 0.61: Q5.C 18.4,36.25 16.82,35.5 16.32,34.75 13,34.75 12.77,33.02 IC5.5 12.74,32.05 13.75,30.5 13.75,26.68 R45.2
N$58  (via drill 0.6)
  Top 0.61: U$1.10 73.53,21.29 v73.5,21.25 | v80.53,31.32 80.5,33.13 IC6.8
  Bottom 0.61: v73.5,21.25 72.25,24.25 72.25,25.75 v80.53,31.32
N$59
  Top 0.61: R11.2 17.75,32.25 19.5,33.75 19.5,34.1 Q5.E
N$60
  Top 0.61: IC6.6 79.29,24.04 78.75,23.2 73.8,23.2 72.88,22.57 70.17,22.57 U$1.11
N$61  (via drill 0.6)
  Top 0.61: SJ4.2 SJ3.2 SJ2.2 SJ1.2 85.24,21.01 84.05,23 v81,24.18 | IC6.1 70.68,26.93 68.5,24.5 68.5,20 70.14,20 U$1.9 | IC6.1 72.95,26.74 | v73.92,24.82 73,25.75 73,26.87 IC6.1
  Bottom 0.61: v81,24.18 79.7,25.32 79.28,26 75,26 73.92,24.93 v73.92,24.82
N$62
  Top 0.61: IC2.15 88.61,18.14 87.75,19 87.75,19.24 SJ1.1
N$63
  Top 0.61: IC2.14 89.88,19.36 SJ2.1
N$64
  Top 0.61: IC2.13 91.14,19.13 SJ3.1
N$65
  Top 0.61: IC2.12 92.42,17.9 SJ4.1
N$66
  Top 0.61: X1.B31 86.83,6.83 87.9,8.35 88.6,9.3 88.65,9.75 88.65,10.99 IC2.2
N$67
  Top 0.61: X1.B32 89.5,5.27 91.15,7.7 91.12,10.83 IC2.4
N$68
  Top 0.61: X1.A31 86.83,3.08 88.12,4.28 88.12,6.53 88.5,7 89.83,8.3 89.85,9.53 89.85,10.82 IC2.3
N$69
  Top 0.61: IC2.1 87.27,9.57 85.58,7.6 85.58,4.19 X1.A30
N$70
  Top 1.27: U$22.1 45.5,65.25 D16.A
  Top 2.54: U$22.1 X2.P$4
  Bottom 1.27: D12.C 44.6,71.15 X2.P$4 D17.C
  Bottom 2.54: U$22.1 X2.P$4
N$71
  Top 0.61: R2.1 Q11.3
N$72  (via drill 0.6)
  Top 0.61: IC6.3 75.48,24.3 v76.2,24.27
  Bottom 0.61: v76.2,24.27 76.7,23.3 77.92,21.45 77.92,6.5 78.66,5.77 X1.B28
N$73  (via drill 0.6)
  Top 0.61: R43.2 84.2,31.73 84.1,31.93 82.9,32.16 v82.62,32.23
  Top 0.813: IC6.12 75.47,31.55 v76.25,31
  Top 1.27: 82.9,32.16 82.3,32.26
  Bottom 0.61: X1.A29 83.03,3.98 83.03,6 83.81,6.81 84.25,7.31 84.2,31.77 84.1,31.75 83.1,31.75 v82.62,32.23 82.1,33 78,33 v76.25,31
N$74
  Top 0.61: Q11.1 90.05,39.55 C13.1
  Top 0.813: C13.1 92.7,40.12 R32.1 92.85,37 R23.2 93.12,36.73 D13.A
N$75  (via drill 0.6)
  Top 0.254: v33.5,11.75 33.52,11.47 33.61,11.76
  Top 0.61: 30.19,11.7 33.67,11.7 | 29.39,11.9 29.6,11.9 U$3.2
  Top 0.813: 35.15,12.15 C31.1 | 33.67,11.7 33.61,11.76
  Top 1.016: X1.B13 X1.A13 | X1.B12 X1.A12 | 29.39,11.9 30.19,11.7 | 33.52,11.47 v33.52,10.6
  Top 1.27: 33.61,11.76 35.15,12.15 | U$3.2 29.27,11.78 U$4.2 21.23,11.78 10.8,21.65 9.3,21.65 8.5,22.5 8.5,24.75 C68.+
  Bottom 1.676: X1.A13 X1.B13 X1.B12 | X1.B12 X1.A12 | X1.B12 38.57,6.43 37.73,7.58 | 36,8 36.73,7.58
  Bottom 1.778: 36.73,7.58 37.73,7.58
  Bottom 2.184: 36,8 33.25,11.5 U$3.2
  pour Top: 37.25,6 42.25,6 42.25,1.25 37.25,1.25
N$76  (via drill 0.6)
  Top 0.813: v98,35.12 98,36.45 D13.C
  Bottom 0.61: v98,35.12 95.5,34.75 95.5,11.25 91,6.5 91,4.36 X1.A32
N$77  (via drill 0.6)
  Top 0.61: 72.38,10.88 72.75,10.25 | 72.75,10.25 72.5,10.5 | 72.75,10.25 72.85,10.25 | v87.95,34.62 86.45,34.7 86.75,34.75 86.75,34.65 Q12.3
  Top 0.813: U$1.2 72.38,10.88
  Top 1.016: 72.85,10.25 R35.1
  Top 1.27: 72.5,10.5 v72.25,10.75
  Bottom 0.61: v72.25,10.75 70.5,13 68.75,23.5 68.75,27.25 76.5,37.5 84,37.5 v87.95,34.62
N$78
  Top 0.61: U$1.3 71.11,12.39 73.65,11.93 79,11.93 R34.1
N$79  (via drill 0.6)
  Top 0.61: v86,24.25 85.75,26.1 Q13.3
  Top 0.813: U$1.4 72.44,13.66
  Top 1.016: 72.44,13.66 R37.1 v72.5,13.5
  Bottom 0.61: v72.5,13.5 72.5,18 70.5,24.5 70.5,26.75 77.75,36 83.25,36 85.75,34 v86,24.25
N$80
  Top 1.27: U$24.1 55.25,65.75 54.75,65.25 D22.A
  Top 2.54: U$24.1 X2.P$1
  Bottom 1.27: D11.C 56.15,73.9 55.25,73 X2.P$1 D23.C
  Bottom 2.54: U$24.1 X2.P$1
N$82
  Top 0.61: 90.9,32.5 C35.1 90.5,32.9 89.75,34 88.5,36 84.5,36 84.45,35.7 Q12.1
  Top 0.813: 90.9,32.5 R42.1 | R38.2 C35.1
N$83
  Top 0.61: R42.2 95.67,32.52
  Top 1.016: 95.67,32.52 JP1.2
N$84
  Top 0.61: R41.1 96.13,29.98
  Top 1.016: 96.13,29.98 JP1.1
N$85
  Top 0.61: C14.1 R40.1 | C14.1 R36.2 | Q13.1 85.7,27.45 86.47,28.1 89.38,28.1 C14.1
N$86
  Top 0.61: 98.23,26.5 JP3.2
  Top 1.016: R40.2 98.23,26.5
N$87
  Top 0.61: 98.27,24 JP3.1
  Top 1.016: R39.1 98.27,24
N$88
  Top 0.61: IC1.6 48.23,26.59 49.2,25.62 49.2,24.53 SV1.2 49.23,22.03 SJ6.2
N$89
  Top 0.61: IC1.5 46.97,24.77 SV1.1 46.69,22.02 SJ7.2
N$90
  Top 0.61: IC1.8 50.77,28.68 54.3,25.15 SV1.4 54.31,22.1 SJ8.2
N$91  (via drill 0.6)
  Top 0.254: v59.15,48.12 59.02,48.98 59.5,48.75 | 74.35,48.5 74.35,49.05 v74.65,49.1
  Top 0.813: 77.75,48.75 Q4.1 | 61.66,49 Q3.1
  Top 1.016: v70.5,48.25 70,48.25 R31.2
  Top 1.27: 77.75,48.75 76.5,48.75 76,48.5 | 60,48.75 61.66,49 | v69.25,48.25 v70.5,48.25
  Top 2.54: 59.5,48.75 60,48.75 | 74.35,48.5 76,48.5
  Bottom 1.27: v69.25,48.25 70.5,48.6 70,48.85
  Bottom 1.676: v74.65,49.1 74.5,48.5 72.5,48.75 72.06,48.69 71.22,48.85 70,48.85 v60.27,49.42
  Bottom 1.778: 72.5,49.75 72.5,52
  other vias: 75.97,49.12 76.08,47.9 74.78,47.95 60.3,48.2 59.12,49.4
  pour Bottom (rank 4): 58.5,47.5 58.5,51.75 70,51.75 70,53.75 74.75,53.75 74.75,52.75 76.75,52.75 76.75,47.5
N$94
  Top 2.54: U$25.1 X2.P$3
  Bottom 1.016: D19.C 42.75,76.75 47.23,76.75 D12.A
  Bottom 1.27: D12.A 49,74 48.25,73.25 X2.P$3 | U$25.1 46.25,62.5 D18.A
  Bottom 2.54: U$25.1 X2.P$3
N$95
  Top 2.54: U$23.1 X2.P$2
  Bottom 1.016: D11.A 52.23,74.72 54,76.75 57.75,76.75 D21.C
  Bottom 1.27: X2.P$2 D11.A | U$23.1 52.5,64.25 54.25,62.5 D20.A
  Bottom 2.54: X2.P$2 51.75,66
VCC  (via drill 0.6)
  Top 0.254: 49.5,41.75 49.33,42.17 | 50.6,40.12 IC1.21 | 27.48,13.48 U$4.3 | 50.63,37.04 50.75,36.99 50.45,37.35 | 57.25,33.48 57.75,33.48 57.67,33.3 v57,33.77 57.55,33.3 57.58,33.83 | 61.75,14.2 61.75,14 | 43.28,10.83 IC4.15 | R34.2 79.88,9.35 79.88,9.38 | 68,14 66.5,14 66.5,13.75
  Top 0.61: IC3.15 IC3.16 30.38,16.87 | 12.65,22 12.9,21.75 14.88,21.75 | R11.1 17,27 17.65,25.5 17.65,22.5 17,22 12.65,22 | 12.65,22 12.55,22.12 12.57,22.4 12.57,28.5 | v33.42,23.82 33.75,24.65 34.75,26.25 R6.2 | C9.1 19.9,18.75 20.5,19 20,18 | IC4.15 43.58,10.08 | C32.1 58.8,15.4 60,14.2 | 61.88,14.2 U$1.20 | 72.5,15.75 72.65,15.75 C34.1 | U$2.1 U$2.4 82.61,15.96 C12.1 82.65,14.7 | C19.1 75,15.5 | 77.25,14.35 R37.2 77.47,13.65 | R34.2 79.35,9.75 | 82.17,13.65 82.25,13.8 | C20.1 71.25,33.25 | 72.76,33.25 IC6.14 | R39.2 92.75,23.85 93.1,23.85 94.25,25 94.25,28.25 94.1,28.25 R41.2 92.85,29.6 94.25,31 94.25,34.25 94.12,34.38 94.5,34.75 95.75,34.75 96.58,35.5 96.58,38.45 94.25,38.45 94.25,41.5 | IC2.6 93.69,13.56 93.67,14.25 85.75,14.25 85.38,15.12 86,15.25 85.4,15.25 C23.1 86.84,16.99 IC2.16 | C32.1 59.1,15.4 59.5,15 | IC1.10 53.33,33.35 53.58,33.83 | U$1.21 59.98,13.66 C32.1 | 39.08,10.4 C17.1
  Top 0.813: IC4.15 IC4.16 | 60,14.2 61.75,14.2 61.88,14.2 | 77.47,13.65 82.17,13.65 | 85.15,15.5 C23.1 | 70.5,33.25 C20.1 | R39.2 92.85,22.9 93.75,22.07 96.25,22.07 97.5,19.5 | 97.5,14.75 97.5,19.5 | 85.38,15.12 84.5,14.75 | C38.1 98.25,18.75 97.5,19.5 | R7.2 92.88,42.88 94.25,41.5 | U$3.3 28.76,14.05 | JMP2.1 58.55,35.05 57.75,34.25 57.75,33.48 57.75,33.42 v57,33.77 | 57.58,33.83 56.27,33.5 v55.5,33.77 | 38.88,10.55 39.08,10.4 | IC5.4 11.5,29.65 C18.1 11.85,29.32 12.57,28.5 | 49.33,42.17 49.67,42.17 C1.1 | 73,8.75 79.25,8.75 79.88,9.38 80,9.5
  Top 1.016: 30.38,16.87 28.5,19 20.5,19 | 19.2,17.5 20,18 | U$1.5 71.69,14.94 72.5,15.75 | C34.1 C19.1 | 75,15.5 76.75,15.5 77.25,14.35 | 82.17,13.65 82.65,14.7 | 82.25,13.8 82.25,10.25 82,10.25 R35.2 | C12.1 85.15,15.5 | 50.63,37.04 50.6,37.9 50.6,40.12 50.52,40.8 50.1,41.23 49.5,41.75 | 28.25,14.5 27.48,13.48 | C17.1 43.28,10.83 | 67.75,9.25 68,9.25 68.5,8.75 73,8.75
  Top 1.27: v20.12,15.1 20.12,15.24 19.2,17.5 v18,17.5 16.5,18.5 14.88,21.75 | U$1.20 U$1.5 | 71.25,33.25 72.76,33.25 | v69.5,33.75 70.5,33.25 | 59.5,15 v64.5,15 | 53.58,33.83 50.45,37.35 | C32.1 C43.1 54.08,13.97 54.1,10.3 52.5,8.85 39.17,8.82 38.9,8.88 38.88,10.55 38.85,11.9 37.5,13.97 36.73,14.12 | 84.5,14.75 97.5,14.75 | 47.08,43.02 C36.1 | 47.08,43.02 C8.1 | 49.33,42.17 47.08,43.02 | v54.05,33.77 57.58,33.83 | 28.25,14.5 27,13.75 v21.5,13.75 20.25,15 | C30.1 32.02,14 30.5,14.5 26.9,14.15 | 61.75,14 68,14 68,14.5 | 66.5,10.5 67.75,9.25 | 82,10.25 84,15 | v69.5,33.75 v68.25,33.75 | C67.1 71,35.25 v69.5,33.75
  Top 1.422: v64.5,15 v64.5,16.5 v64.5,24 v64.5,25.25 | 28.25,14.5 30.5,14.5
  Top 1.676: 57.58,33.83 53.58,33.83 | 26.9,14.15 36.73,14.12
  Top 2.54: 66.5,13.75 66.5,10.5
  Bottom 0.61: v33.42,23.82 32.58,23.57 24.25,20.25 v18,17.5
  Bottom 0.813: 28.75,13.75 28.96,14
  Bottom 1.016: v21.5,13.75 28.75,13.75
  Bottom 1.27: 53.98,33.85 v54.05,33.77 | v20.12,15.1 v21.5,13.75 | 28.96,14 U$3.3
  Bottom 1.422: 64.6,33.85 64.46,33.75 v69.5,33.75
  Bottom 1.676: 64.6,33.85 53.98,33.85
  Bottom 1.93: 64.46,33.75 v64.5,25.25 v64.5,15